# EAGLE schematic modul_frequency (EAGLE 7.7.0)

## Sheet 1 of 5
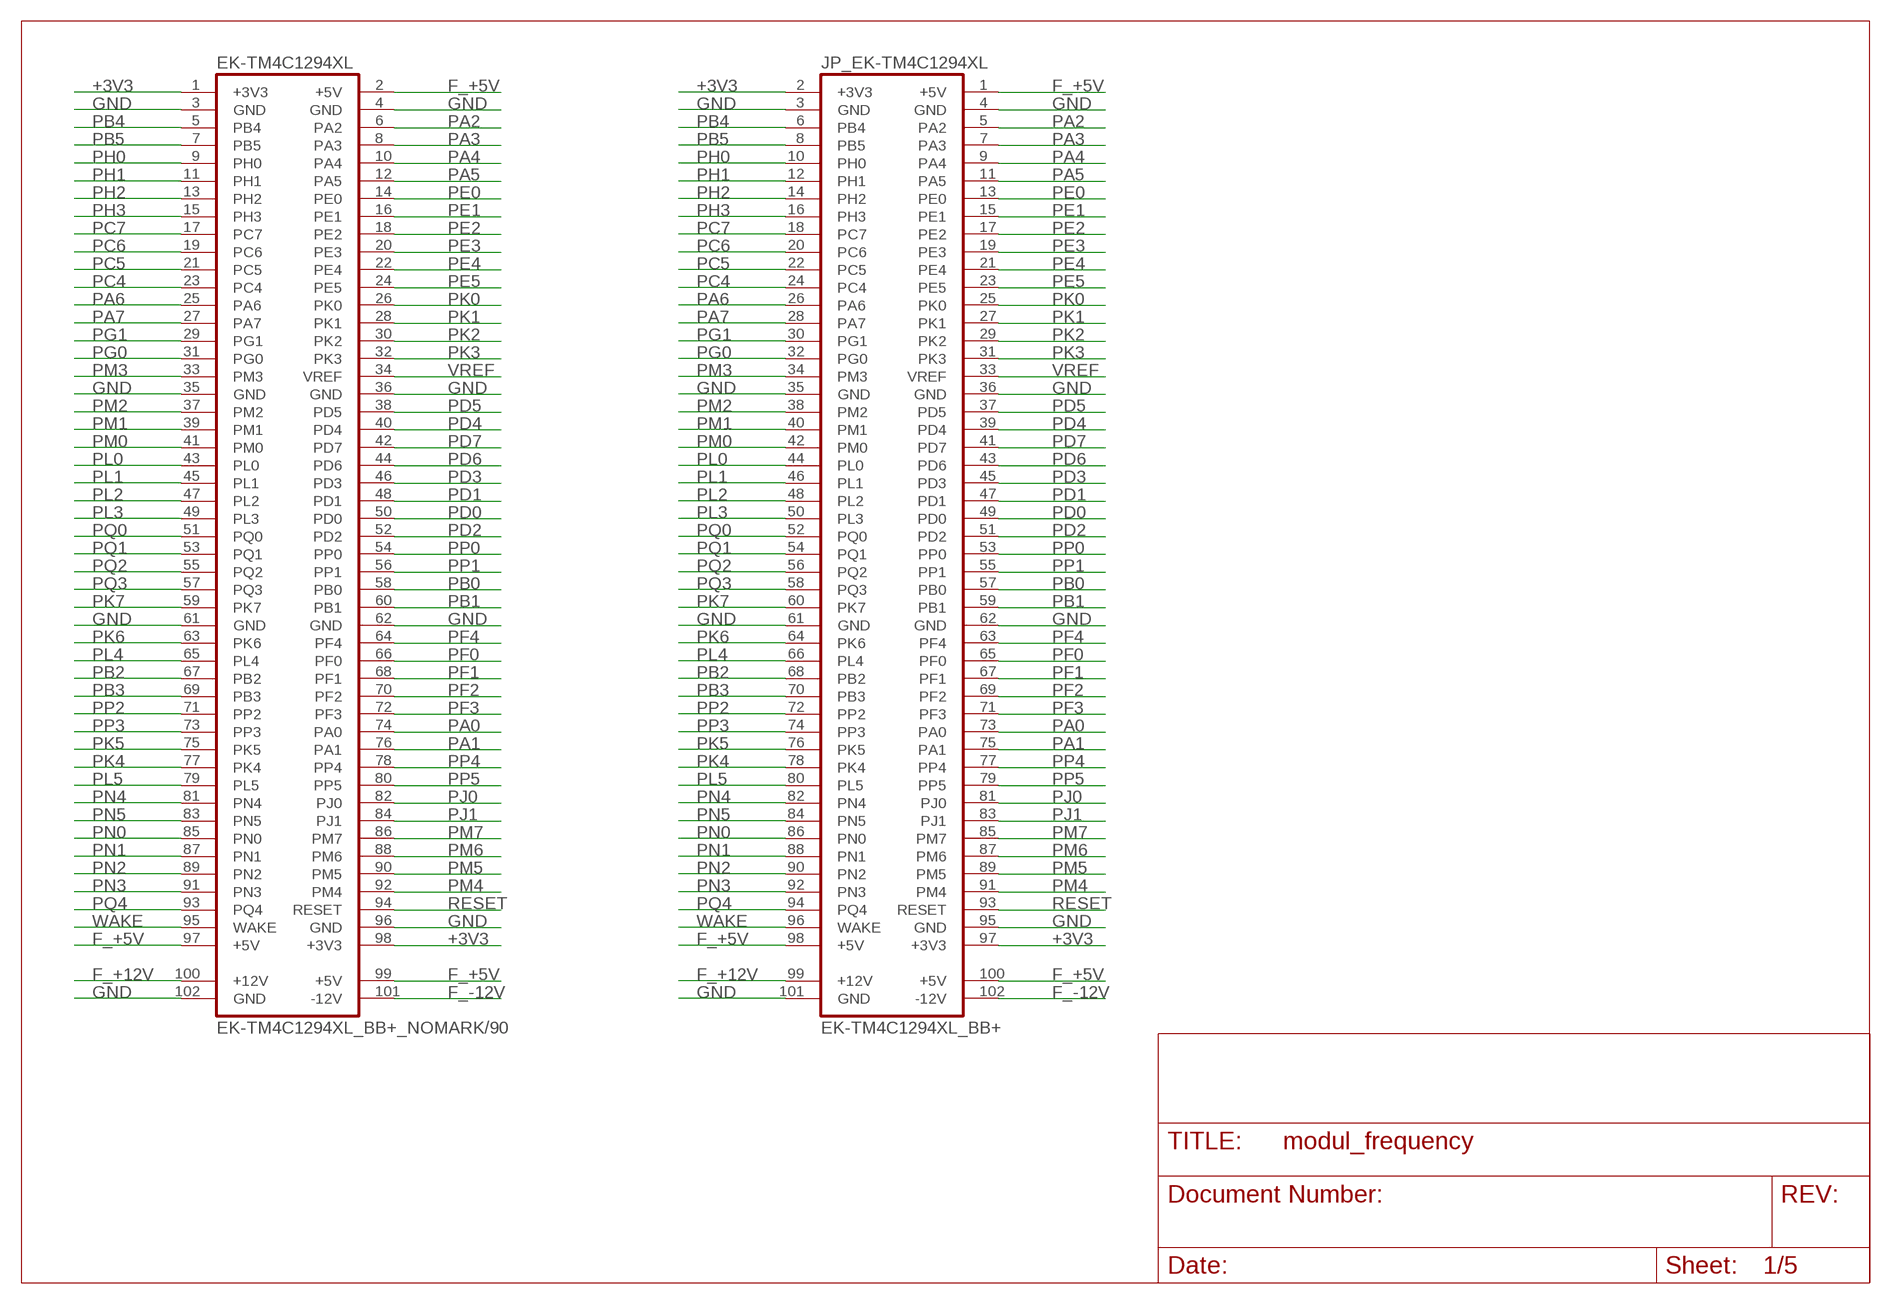
[diagram p0: schematic, sheet 1]

### Parts
EK-TM4C1294XL  EK-TM4C1294XL_BB+_NOMARK/90  [EK-TM4C1294XL_BB+_NOMARK/90]
JP_EK-TM4C1294XL  EK-TM4C1294XL_BB+  [EK-TM4C1294XL_BB+]

### Nets
+3V3: EK-TM4C1294XL.1(+3V3) EK-TM4C1294XL.98(+3V3) JP_EK-TM4C1294XL.2(+3V3) JP_EK-TM4C1294XL.97(+3V3) ; also sheet 2,3,4,5
F_+5V: EK-TM4C1294XL.2(+5V) EK-TM4C1294XL.97(+5V) EK-TM4C1294XL.99(+5V) JP_EK-TM4C1294XL.1(+5V) JP_EK-TM4C1294XL.98(+5V) JP_EK-TM4C1294XL.100(+5V) ; also sheet 2,3,4,5
F_+12V: EK-TM4C1294XL.100(+12V) JP_EK-TM4C1294XL.99(+12V) ; also sheet 4,5
F_-12V: EK-TM4C1294XL.101(-12V) JP_EK-TM4C1294XL.102(-12V)
GND: EK-TM4C1294XL.3(GND) EK-TM4C1294XL.4(GND) EK-TM4C1294XL.35(GND) EK-TM4C1294XL.36(GND) EK-TM4C1294XL.61(GND) EK-TM4C1294XL.62(GND) EK-TM4C1294XL.96(GND) EK-TM4C1294XL.102(GND) JP_EK-TM4C1294XL.3(GND) JP_EK-TM4C1294XL.4(GND) JP_EK-TM4C1294XL.35(GND) JP_EK-TM4C1294XL.36(GND) JP_EK-TM4C1294XL.61(GND) JP_EK-TM4C1294XL.62(GND) JP_EK-TM4C1294XL.95(GND) JP_EK-TM4C1294XL.101(GND) ; also sheet 2,3,5
PA0: EK-TM4C1294XL.74(PA0) JP_EK-TM4C1294XL.73(PA0) ; also sheet 4
PA1: EK-TM4C1294XL.76(PA1) JP_EK-TM4C1294XL.75(PA1) ; also sheet 4
PA2: EK-TM4C1294XL.6(PA2) JP_EK-TM4C1294XL.5(PA2) ; also sheet 4
PA3: EK-TM4C1294XL.8(PA3) JP_EK-TM4C1294XL.7(PA3) ; also sheet 4
PA4: EK-TM4C1294XL.10(PA4) JP_EK-TM4C1294XL.9(PA4) ; also sheet 4
PA5: EK-TM4C1294XL.12(PA5) JP_EK-TM4C1294XL.11(PA5) ; also sheet 4
PA6: EK-TM4C1294XL.25(PA6) JP_EK-TM4C1294XL.26(PA6) ; also sheet 4
PA7: EK-TM4C1294XL.27(PA7) JP_EK-TM4C1294XL.28(PA7) ; also sheet 4
PB0: EK-TM4C1294XL.58(PB0) JP_EK-TM4C1294XL.57(PB0)
PB1: EK-TM4C1294XL.60(PB1) JP_EK-TM4C1294XL.59(PB1)
PB2: EK-TM4C1294XL.67(PB2) JP_EK-TM4C1294XL.68(PB2)
PB3: EK-TM4C1294XL.69(PB3) JP_EK-TM4C1294XL.70(PB3)
PB4: EK-TM4C1294XL.5(PB4) JP_EK-TM4C1294XL.6(PB4)
PB5: EK-TM4C1294XL.7(PB5) JP_EK-TM4C1294XL.8(PB5)
PC4: EK-TM4C1294XL.23(PC4) JP_EK-TM4C1294XL.24(PC4)
PC5: EK-TM4C1294XL.21(PC5) JP_EK-TM4C1294XL.22(PC5)
PC6: EK-TM4C1294XL.19(PC6) JP_EK-TM4C1294XL.20(PC6)
PC7: EK-TM4C1294XL.17(PC7) JP_EK-TM4C1294XL.18(PC7)
PD0: EK-TM4C1294XL.50(PD0) JP_EK-TM4C1294XL.49(PD0) ; also sheet 4
PD1: EK-TM4C1294XL.48(PD1) JP_EK-TM4C1294XL.47(PD1) ; also sheet 4
PD2: EK-TM4C1294XL.52(PD2) JP_EK-TM4C1294XL.51(PD2) ; also sheet 4
PD3: EK-TM4C1294XL.46(PD3) JP_EK-TM4C1294XL.45(PD3) ; also sheet 4
PD4: EK-TM4C1294XL.40(PD4) JP_EK-TM4C1294XL.39(PD4) ; also sheet 4
PD5: EK-TM4C1294XL.38(PD5) JP_EK-TM4C1294XL.37(PD5) ; also sheet 4
PD6: EK-TM4C1294XL.44(PD6) JP_EK-TM4C1294XL.43(PD6)
PD7: EK-TM4C1294XL.42(PD7) JP_EK-TM4C1294XL.41(PD7)
PE0: EK-TM4C1294XL.14(PE0) JP_EK-TM4C1294XL.13(PE0)
PE1: EK-TM4C1294XL.16(PE1) JP_EK-TM4C1294XL.15(PE1)
PE2: EK-TM4C1294XL.18(PE2) JP_EK-TM4C1294XL.17(PE2)
PE3: EK-TM4C1294XL.20(PE3) JP_EK-TM4C1294XL.19(PE3)
PE4: EK-TM4C1294XL.22(PE4) JP_EK-TM4C1294XL.21(PE4)
PE5: EK-TM4C1294XL.24(PE5) JP_EK-TM4C1294XL.23(PE5)
PF0: EK-TM4C1294XL.66(PF0) JP_EK-TM4C1294XL.65(PF0)
PF1: EK-TM4C1294XL.68(PF1) JP_EK-TM4C1294XL.67(PF1)
PF2: EK-TM4C1294XL.70(PF2) JP_EK-TM4C1294XL.69(PF2)
PF3: EK-TM4C1294XL.72(PF3) JP_EK-TM4C1294XL.71(PF3)
PF4: EK-TM4C1294XL.64(PF4) JP_EK-TM4C1294XL.63(PF4)
PG0: EK-TM4C1294XL.31(PG0) JP_EK-TM4C1294XL.32(PG0)
PG1: EK-TM4C1294XL.29(PG1) JP_EK-TM4C1294XL.30(PG1)
PH0: EK-TM4C1294XL.9(PH0) JP_EK-TM4C1294XL.10(PH0)
PH1: EK-TM4C1294XL.11(PH1) JP_EK-TM4C1294XL.12(PH1)
PH2: EK-TM4C1294XL.13(PH2) JP_EK-TM4C1294XL.14(PH2)
PH3: EK-TM4C1294XL.15(PH3) JP_EK-TM4C1294XL.16(PH3)
PJ0: EK-TM4C1294XL.82(PJ0) JP_EK-TM4C1294XL.81(PJ0)
PJ1: EK-TM4C1294XL.84(PJ1) JP_EK-TM4C1294XL.83(PJ1)
PK0: EK-TM4C1294XL.26(PK0) JP_EK-TM4C1294XL.25(PK0) ; also sheet 4
PK1: EK-TM4C1294XL.28(PK1) JP_EK-TM4C1294XL.27(PK1) ; also sheet 4
PK2: EK-TM4C1294XL.30(PK2) JP_EK-TM4C1294XL.29(PK2) ; also sheet 4
PK3: EK-TM4C1294XL.32(PK3) JP_EK-TM4C1294XL.31(PK3) ; also sheet 4
PK4: EK-TM4C1294XL.77(PK4) JP_EK-TM4C1294XL.78(PK4)
PK5: EK-TM4C1294XL.75(PK5) JP_EK-TM4C1294XL.76(PK5)
PK6: EK-TM4C1294XL.63(PK6) JP_EK-TM4C1294XL.64(PK6)
PK7: EK-TM4C1294XL.59(PK7) JP_EK-TM4C1294XL.60(PK7)
PL0: EK-TM4C1294XL.43(PL0) JP_EK-TM4C1294XL.44(PL0)
PL1: EK-TM4C1294XL.45(PL1) JP_EK-TM4C1294XL.46(PL1)
PL2: EK-TM4C1294XL.47(PL2) JP_EK-TM4C1294XL.48(PL2)
PL3: EK-TM4C1294XL.49(PL3) JP_EK-TM4C1294XL.50(PL3)
PL4: EK-TM4C1294XL.65(PL4) JP_EK-TM4C1294XL.66(PL4) ; also sheet 4
PL5: EK-TM4C1294XL.79(PL5) JP_EK-TM4C1294XL.80(PL5) ; also sheet 4
PM0: EK-TM4C1294XL.41(PM0) JP_EK-TM4C1294XL.42(PM0) ; also sheet 4
PM1: EK-TM4C1294XL.39(PM1) JP_EK-TM4C1294XL.40(PM1) ; also sheet 4
PM2: EK-TM4C1294XL.37(PM2) JP_EK-TM4C1294XL.38(PM2) ; also sheet 4
PM3: EK-TM4C1294XL.33(PM3) JP_EK-TM4C1294XL.34(PM3) ; also sheet 4
PM4: EK-TM4C1294XL.92(PM4) JP_EK-TM4C1294XL.91(PM4) ; also sheet 4
PM5: EK-TM4C1294XL.90(PM5) JP_EK-TM4C1294XL.89(PM5) ; also sheet 4
PM6: EK-TM4C1294XL.88(PM6) JP_EK-TM4C1294XL.87(PM6) ; also sheet 4
PM7: EK-TM4C1294XL.86(PM7) JP_EK-TM4C1294XL.85(PM7) ; also sheet 4
PN0: EK-TM4C1294XL.85(PN0) JP_EK-TM4C1294XL.86(PN0)
PN1: EK-TM4C1294XL.87(PN1) JP_EK-TM4C1294XL.88(PN1)
PN2: EK-TM4C1294XL.89(PN2) JP_EK-TM4C1294XL.90(PN2)
PN3: EK-TM4C1294XL.91(PN3) JP_EK-TM4C1294XL.92(PN3)
PN4: EK-TM4C1294XL.81(PN4) JP_EK-TM4C1294XL.82(PN4)
PN5: EK-TM4C1294XL.83(PN5) JP_EK-TM4C1294XL.84(PN5)
PP0: EK-TM4C1294XL.54(PP0) JP_EK-TM4C1294XL.53(PP0)
PP1: EK-TM4C1294XL.56(PP1) JP_EK-TM4C1294XL.55(PP1)
PP2: EK-TM4C1294XL.71(PP2) JP_EK-TM4C1294XL.72(PP2)
PP3: EK-TM4C1294XL.73(PP3) JP_EK-TM4C1294XL.74(PP3)
PP4: EK-TM4C1294XL.78(PP4) JP_EK-TM4C1294XL.77(PP4)
PP5: EK-TM4C1294XL.80(PP5) JP_EK-TM4C1294XL.79(PP5)
PQ0: EK-TM4C1294XL.51(PQ0) JP_EK-TM4C1294XL.52(PQ0)
PQ1: EK-TM4C1294XL.53(PQ1) JP_EK-TM4C1294XL.54(PQ1)
PQ2: EK-TM4C1294XL.55(PQ2) JP_EK-TM4C1294XL.56(PQ2)
PQ3: EK-TM4C1294XL.57(PQ3) JP_EK-TM4C1294XL.58(PQ3)
PQ4: EK-TM4C1294XL.93(PQ4) JP_EK-TM4C1294XL.94(PQ4)
RESET: EK-TM4C1294XL.94(RESET) JP_EK-TM4C1294XL.93(RESET)
VREF: EK-TM4C1294XL.34(VREF) JP_EK-TM4C1294XL.33(VREF)
WAKE: EK-TM4C1294XL.95(WAKE) JP_EK-TM4C1294XL.96(WAKE)

## Sheet 2 of 5
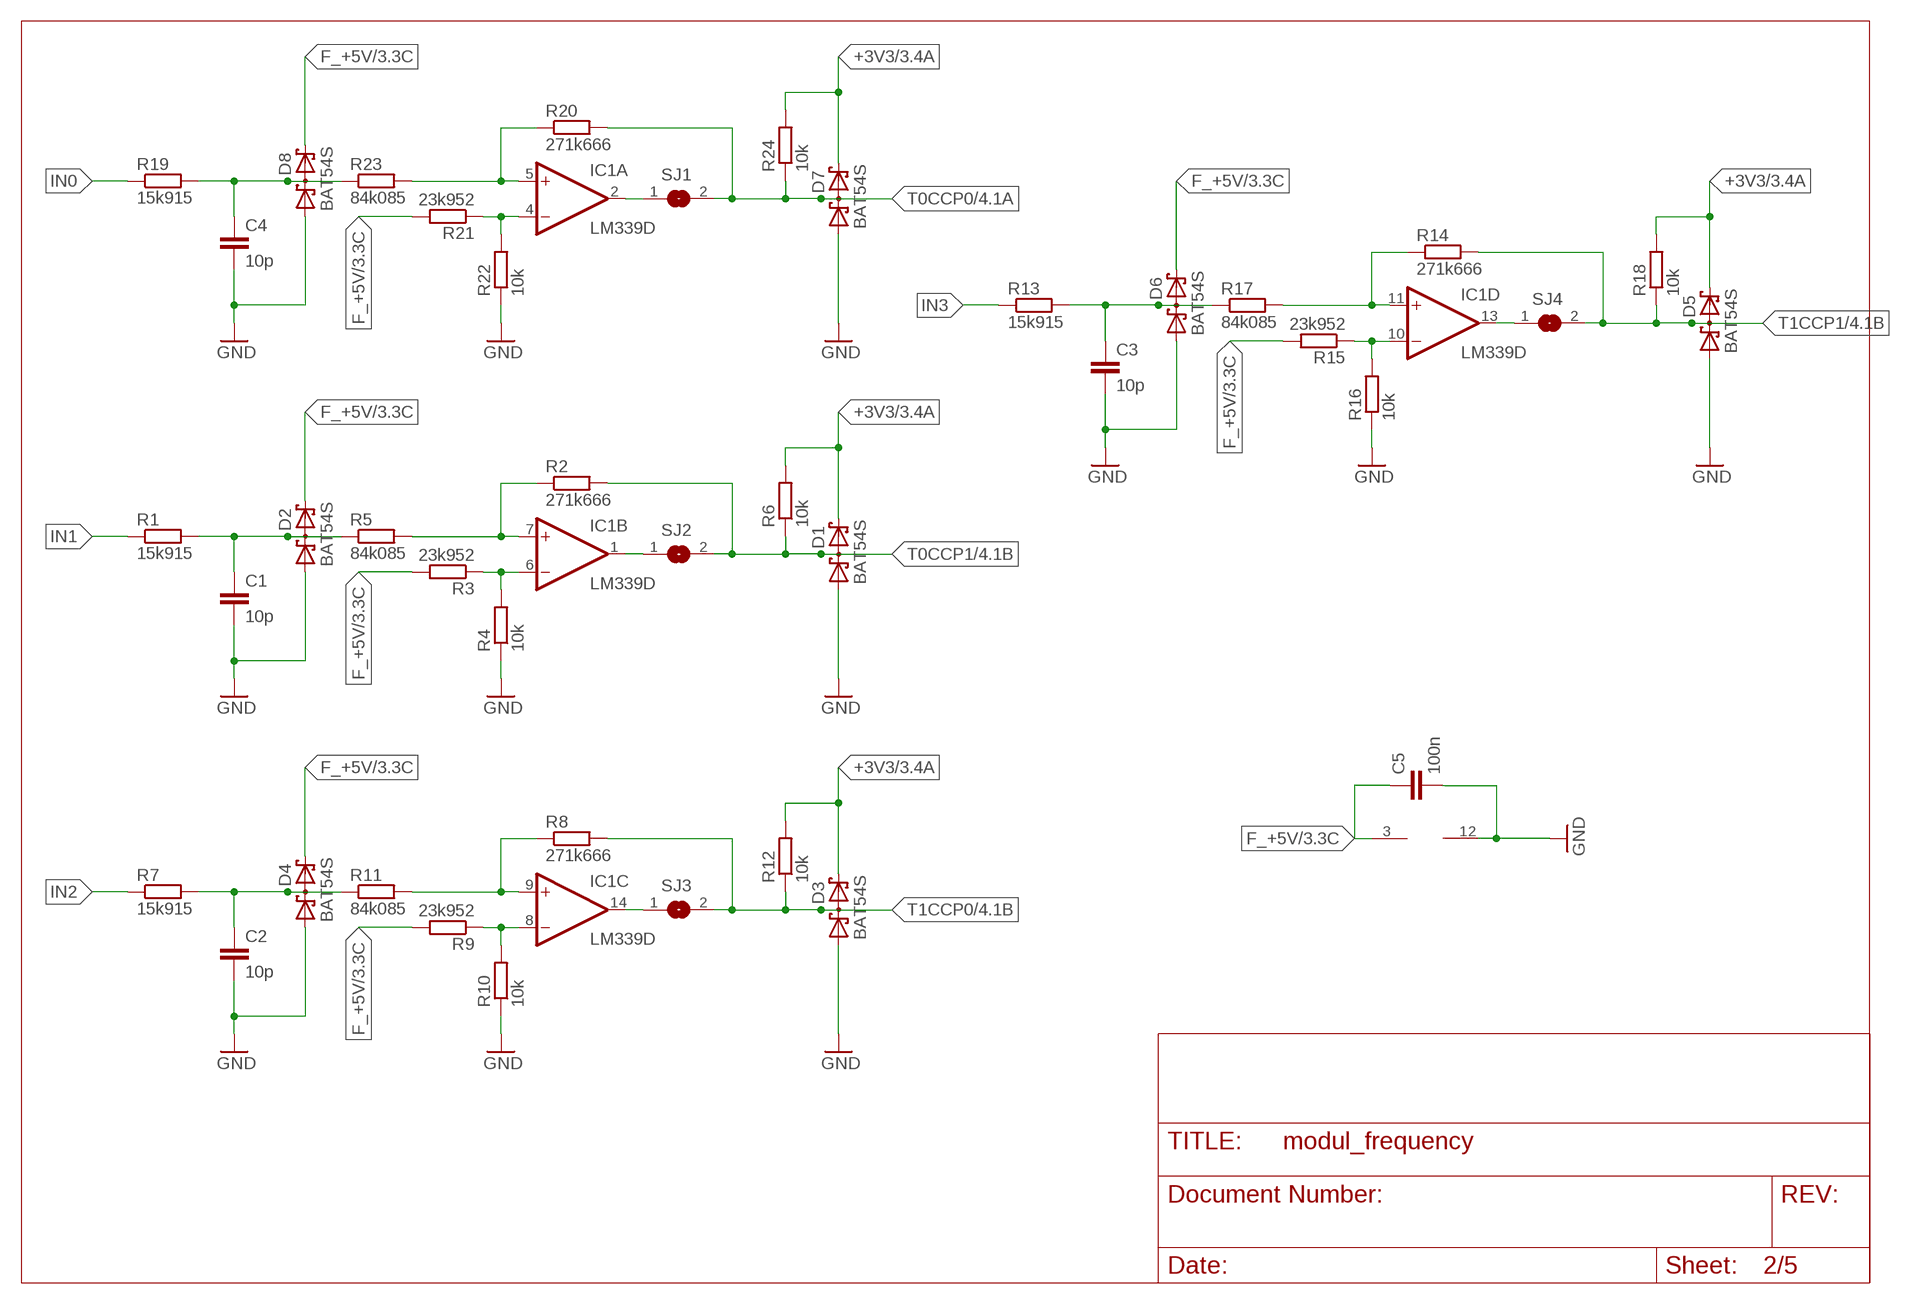
[diagram p1: schematic, sheet 2]

### Parts
C1  10p  C-EUC0805  [C0805]
C2  10p  C-EUC0805  [C0805]
C3  10p  C-EUC0805  [C0805]
C4  10p  C-EUC0805  [C0805]
C5  100n  C-EUC0805  [C0805]
D1  BAT54S  [SOT23]
D2  BAT54S  [SOT23]
D3  BAT54S  [SOT23]
D4  BAT54S  [SOT23]
D5  BAT54S  [SOT23]
D6  BAT54S  [SOT23]
D7  BAT54S  [SOT23]
D8  BAT54S  [SOT23]
IC1  LM339D  [SO14]
R1  15k915  R-EU_R0805  [R0805]
R2  271k666  R-EU_R0805  [R0805]
R3  23k952  R-EU_R0805  [R0805]
R4  10k  R-EU_R0805  [R0805]
R5  84k085  R-EU_R0805  [R0805]
R6  10k  R-EU_R0805  [R0805]
R7  15k915  R-EU_R0805  [R0805]
R8  271k666  R-EU_R0805  [R0805]
R9  23k952  R-EU_R0805  [R0805]
R10  10k  R-EU_R0805  [R0805]
R11  84k085  R-EU_R0805  [R0805]
R12  10k  R-EU_R0805  [R0805]
R13  15k915  R-EU_R0805  [R0805]
R14  271k666  R-EU_R0805  [R0805]
R15  23k952  R-EU_R0805  [R0805]
R16  10k  R-EU_R0805  [R0805]
R17  84k085  R-EU_R0805  [R0805]
R18  10k  R-EU_R0805  [R0805]
R19  15k915  R-EU_R0805  [R0805]
R20  271k666  R-EU_R0805  [R0805]
R21  23k952  R-EU_R0805  [R0805]
R22  10k  R-EU_R0805  [R0805]
R23  84k085  R-EU_R0805  [R0805]
R24  10k  R-EU_R0805  [R0805]
SJ1  SJ  [SJ]
SJ2  SJ  [SJ]
SJ3  SJ  [SJ]
SJ4  SJ  [SJ]

### Nets
+3V3: D1.2(C2) D3.2(C2) D5.2(C2) D7.2(C2) R6.2 R12.2 R18.2 R24.2 ; also sheet 1,3,4,5
F_+5V: C5.1 D2.2(C2) D4.2(C2) D6.2(C2) D8.2(C2) IC1.3(P:V+) R3.2 R9.2 R15.2 R21.2 ; also sheet 1,3,4,5
GND: C1.2 C2.2 C3.2 C4.2 C5.2 D1.1(A1) D2.1(A1) D3.1(A1) D4.1(A1) D5.1(A1) D6.1(A1) D7.1(A1) D8.1(A1) IC1.12(P:GND) R4.1 R10.1 R16.1 R22.1 ; also sheet 1,3,5
IN0: R19.1 ; also sheet 5
IN1: R1.1 ; also sheet 5
IN2: R7.1 ; also sheet 5
IN3: R13.1 ; also sheet 5
N$1: IC1.2(A:OUT) SJ1.1
N$3: IC1.7(B:+IN) R2.1 R5.2
N$4: IC1.6(B:-IN) R3.1 R4.2
N$5: C1.1 D2.3(C1A2) R1.2 R5.1
N$6: IC1.1(B:OUT) SJ2.1
N$7: IC1.9(C:+IN) R8.1 R11.2
N$8: IC1.8(C:-IN) R9.1 R10.2
N$9: C2.1 D4.3(C1A2) R7.2 R11.1
N$10: IC1.5(A:+IN) R20.1 R23.2
N$11: IC1.4(A:-IN) R21.1 R22.2
N$12: C4.1 D8.3(C1A2) R19.2 R23.1
N$13: IC1.14(C:OUT) SJ3.1
N$14: IC1.11(D:+IN) R14.1 R17.2
N$15: IC1.10(D:-IN) R15.1 R16.2
N$16: C3.1 D6.3(C1A2) R13.2 R17.1
N$17: IC1.13(D:OUT) SJ4.1
T0CCP0: D7.3(C1A2) R20.2 R24.1 SJ1.2 ; also sheet 4
T0CCP1: D1.3(C1A2) R2.2 R6.1 SJ2.2 ; also sheet 4
T1CCP0: D3.3(C1A2) R8.2 R12.1 SJ3.2 ; also sheet 4
T1CCP1: D5.3(C1A2) R14.2 R18.1 SJ4.2 ; also sheet 4

## Sheet 3 of 5
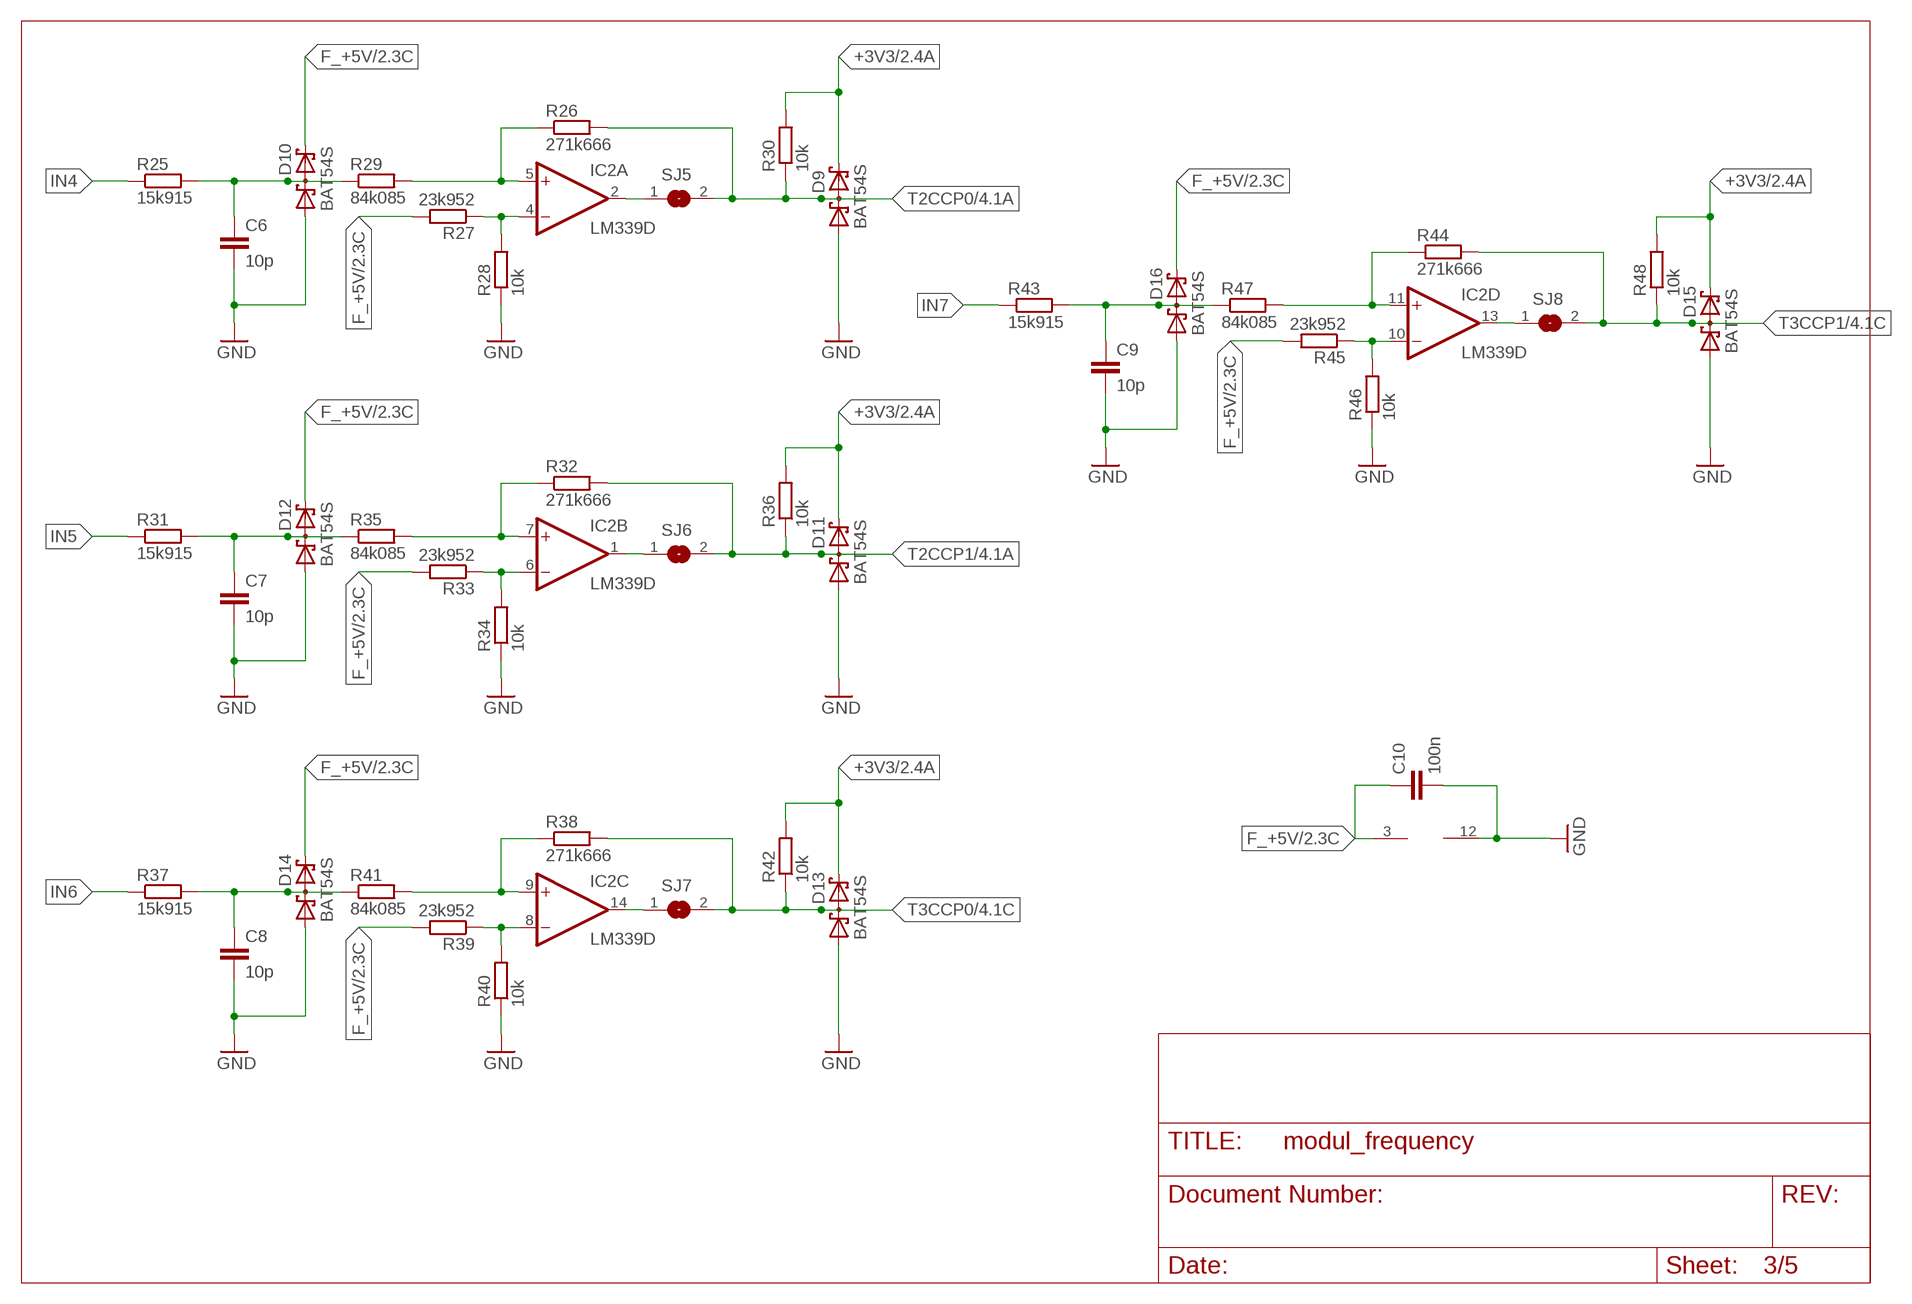
[diagram p2: schematic, sheet 3]

### Parts
C6  10p  C-EUC0805  [C0805]
C7  10p  C-EUC0805  [C0805]
C8  10p  C-EUC0805  [C0805]
C9  10p  C-EUC0805  [C0805]
C10  100n  C-EUC0805  [C0805]
D9  BAT54S  [SOT23]
D10  BAT54S  [SOT23]
D11  BAT54S  [SOT23]
D12  BAT54S  [SOT23]
D13  BAT54S  [SOT23]
D14  BAT54S  [SOT23]
D15  BAT54S  [SOT23]
D16  BAT54S  [SOT23]
IC2  LM339D  [SO14]
R25  15k915  R-EU_R0805  [R0805]
R26  271k666  R-EU_R0805  [R0805]
R27  23k952  R-EU_R0805  [R0805]
R28  10k  R-EU_R0805  [R0805]
R29  84k085  R-EU_R0805  [R0805]
R30  10k  R-EU_R0805  [R0805]
R31  15k915  R-EU_R0805  [R0805]
R32  271k666  R-EU_R0805  [R0805]
R33  23k952  R-EU_R0805  [R0805]
R34  10k  R-EU_R0805  [R0805]
R35  84k085  R-EU_R0805  [R0805]
R36  10k  R-EU_R0805  [R0805]
R37  15k915  R-EU_R0805  [R0805]
R38  271k666  R-EU_R0805  [R0805]
R39  23k952  R-EU_R0805  [R0805]
R40  10k  R-EU_R0805  [R0805]
R41  84k085  R-EU_R0805  [R0805]
R42  10k  R-EU_R0805  [R0805]
R43  15k915  R-EU_R0805  [R0805]
R44  271k666  R-EU_R0805  [R0805]
R45  23k952  R-EU_R0805  [R0805]
R46  10k  R-EU_R0805  [R0805]
R47  84k085  R-EU_R0805  [R0805]
R48  10k  R-EU_R0805  [R0805]
SJ5  SJ  [SJ]
SJ6  SJ  [SJ]
SJ7  SJ  [SJ]
SJ8  SJ  [SJ]

### Nets
+3V3: D9.2(C2) D11.2(C2) D13.2(C2) D15.2(C2) R30.2 R36.2 R42.2 R48.2 ; also sheet 1,2,4,5
F_+5V: C10.1 D10.2(C2) D12.2(C2) D14.2(C2) D16.2(C2) IC2.3(P:V+) R27.2 R33.2 R39.2 R45.2 ; also sheet 1,2,4,5
GND: C6.2 C7.2 C8.2 C9.2 C10.2 D9.1(A1) D10.1(A1) D11.1(A1) D12.1(A1) D13.1(A1) D14.1(A1) D15.1(A1) D16.1(A1) IC2.12(P:GND) R28.1 R34.1 R40.1 R46.1 ; also sheet 1,2,5
IN4: R25.1 ; also sheet 5
IN5: R31.1 ; also sheet 5
IN6: R37.1 ; also sheet 5
IN7: R43.1 ; also sheet 5
N$2: IC2.5(A:+IN) R26.1 R29.2
N$18: IC2.4(A:-IN) R27.1 R28.2
N$19: C6.1 D10.3(C1A2) R25.2 R29.1
N$20: IC2.7(B:+IN) R32.1 R35.2
N$21: IC2.6(B:-IN) R33.1 R34.2
N$22: C7.1 D12.3(C1A2) R31.2 R35.1
N$23: IC2.1(B:OUT) SJ6.1
N$24: IC2.9(C:+IN) R38.1 R41.2
N$25: IC2.8(C:-IN) R39.1 R40.2
N$26: C8.1 D14.3(C1A2) R37.2 R41.1
N$27: IC2.14(C:OUT) SJ7.1
N$28: IC2.11(D:+IN) R44.1 R47.2
N$29: IC2.10(D:-IN) R45.1 R46.2
N$30: C9.1 D16.3(C1A2) R43.2 R47.1
N$31: IC2.13(D:OUT) SJ8.1
N$32: IC2.2(A:OUT) SJ5.1
T2CCP0: D9.3(C1A2) R26.2 R30.1 SJ5.2 ; also sheet 4
T2CCP1: D11.3(C1A2) R32.2 R36.1 SJ6.2 ; also sheet 4
T3CCP0: D13.3(C1A2) R38.2 R42.1 SJ7.2 ; also sheet 4
T3CCP1: D15.3(C1A2) R44.2 R48.1 SJ8.2 ; also sheet 4

## Sheet 4 of 5
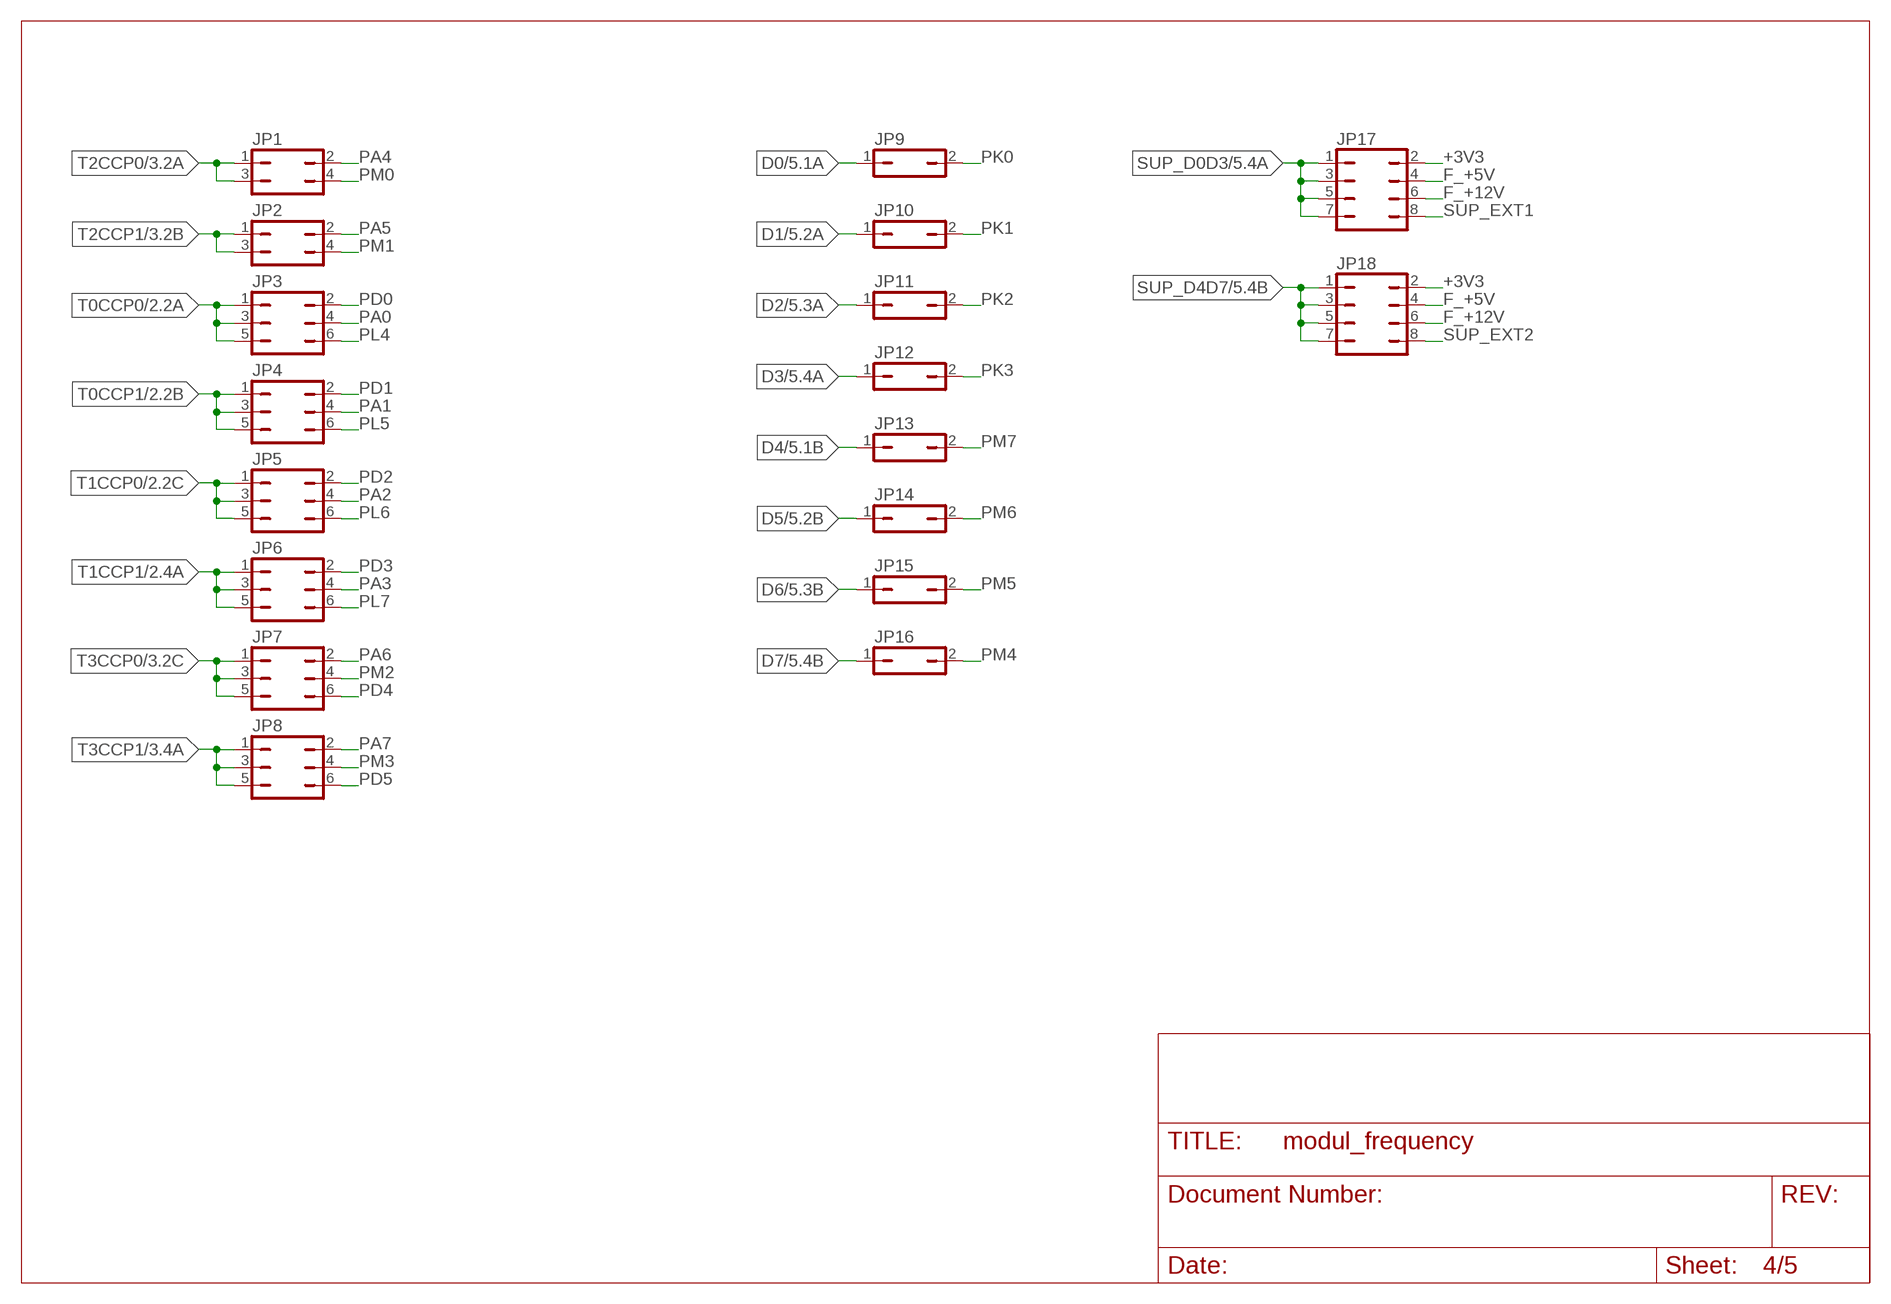
[diagram p3: schematic, sheet 4]

### Parts
JP1  JP2Q  [JP2Q]
JP2  JP2Q  [JP2Q]
JP3  JP3Q  [JP3Q]
JP4  JP3Q  [JP3Q]
JP5  JP3Q  [JP3Q]
JP6  JP3Q  [JP3Q]
JP7  JP3Q  [JP3Q]
JP8  JP3Q  [JP3Q]
JP9  JP1Q  [JP1]
JP10  JP1Q  [JP1]
JP11  JP1Q  [JP1]
JP12  JP1Q  [JP1]
JP13  JP1Q  [JP1]
JP14  JP1Q  [JP1]
JP15  JP1Q  [JP1]
JP16  JP1Q  [JP1]
JP17  JP4Q  [JP4Q]
JP18  JP4Q  [JP4Q]

### Nets
+3V3: JP17.2 JP18.2 ; also sheet 1,2,3,5
D0: JP9.1 ; also sheet 5
D1: JP10.1 ; also sheet 5
D2: JP11.1 ; also sheet 5
D3: JP12.1 ; also sheet 5
D4: JP13.1 ; also sheet 5
D5: JP14.1 ; also sheet 5
D6: JP15.1 ; also sheet 5
D7: JP16.1 ; also sheet 5
F_+5V: JP17.4 JP18.4 ; also sheet 1,2,3,5
F_+12V: JP17.6 JP18.6 ; also sheet 1,5
PA0: JP3.4 ; also sheet 1
PA1: JP4.4 ; also sheet 1
PA2: JP5.4 ; also sheet 1
PA3: JP6.4 ; also sheet 1
PA4: JP1.2 ; also sheet 1
PA5: JP2.2 ; also sheet 1
PA6: JP7.2 ; also sheet 1
PA7: JP8.2 ; also sheet 1
PD0: JP3.2 ; also sheet 1
PD1: JP4.2 ; also sheet 1
PD2: JP5.2 ; also sheet 1
PD3: JP6.2 ; also sheet 1
PD4: JP7.6 ; also sheet 1
PD5: JP8.6 ; also sheet 1
PK0: JP9.2 ; also sheet 1
PK1: JP10.2 ; also sheet 1
PK2: JP11.2 ; also sheet 1
PK3: JP12.2 ; also sheet 1
PL4: JP3.6 ; also sheet 1
PL5: JP4.6 ; also sheet 1
PL6: JP5.6
PL7: JP6.6
PM0: JP1.4 ; also sheet 1
PM1: JP2.4 ; also sheet 1
PM2: JP7.4 ; also sheet 1
PM3: JP8.4 ; also sheet 1
PM4: JP16.2 ; also sheet 1
PM5: JP15.2 ; also sheet 1
PM6: JP14.2 ; also sheet 1
PM7: JP13.2 ; also sheet 1
SUP_D0D3: JP17.1 JP17.3 JP17.5 JP17.7 ; also sheet 5
SUP_D4D7: JP18.1 JP18.3 JP18.5 JP18.7 ; also sheet 5
SUP_EXT1: JP17.8 ; also sheet 5
SUP_EXT2: JP18.8 ; also sheet 5
T0CCP0: JP3.1 JP3.3 JP3.5 ; also sheet 2
T0CCP1: JP4.1 JP4.3 JP4.5 ; also sheet 2
T1CCP0: JP5.1 JP5.3 JP5.5 ; also sheet 2
T1CCP1: JP6.1 JP6.3 JP6.5 ; also sheet 2
T2CCP0: JP1.1 JP1.3 ; also sheet 3
T2CCP1: JP2.1 JP2.3 ; also sheet 3
T3CCP0: JP7.1 JP7.3 JP7.5 ; also sheet 3
T3CCP1: JP8.1 JP8.3 JP8.5 ; also sheet 3

## Sheet 5 of 5
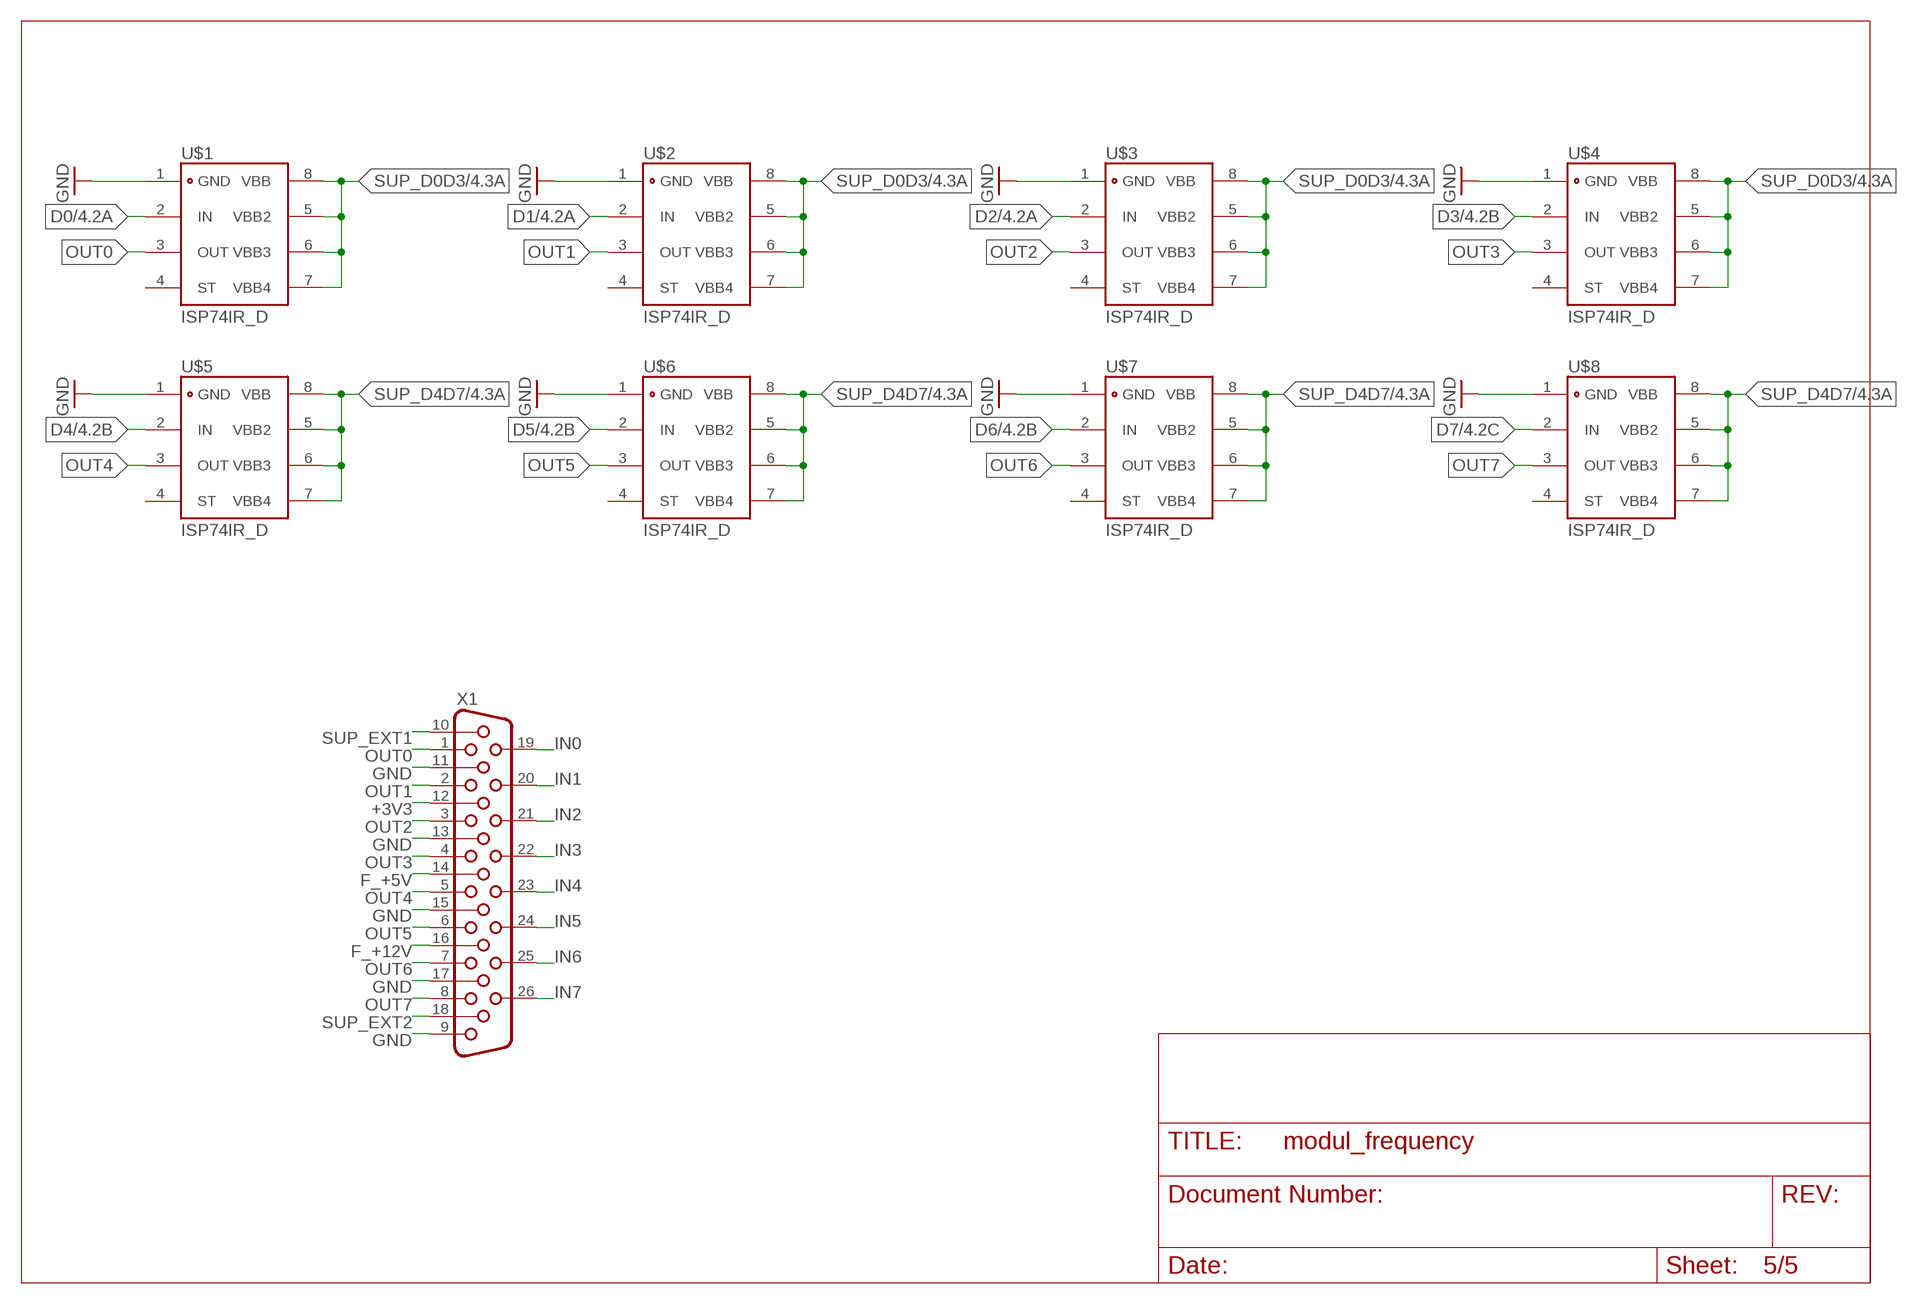
[diagram p4: schematic, sheet 5]

### Parts
U$1  ISP74IR_D  [SO08]
U$2  ISP74IR_D  [SO08]
U$3  ISP74IR_D  [SO08]
U$4  ISP74IR_D  [SO08]
U$5  ISP74IR_D  [SO08]
U$6  ISP74IR_D  [SO08]
U$7  ISP74IR_D  [SO08]
U$8  ISP74IR_D  [SO08]
X1  HF26H  [HDF26H]

### Nets
+3V3: X1.12 ; also sheet 1,2,3,4
D0: U$1.2(IN) ; also sheet 4
D1: U$2.2(IN) ; also sheet 4
D2: U$3.2(IN) ; also sheet 4
D3: U$4.2(IN) ; also sheet 4
D4: U$5.2(IN) ; also sheet 4
D5: U$6.2(IN) ; also sheet 4
D6: U$7.2(IN) ; also sheet 4
D7: U$8.2(IN) ; also sheet 4
F_+5V: X1.14 ; also sheet 1,2,3,4
F_+12V: X1.16 ; also sheet 1,4
GND: U$1.1(GND) U$2.1(GND) U$3.1(GND) U$4.1(GND) U$5.1(GND) U$6.1(GND) U$7.1(GND) U$8.1(GND) X1.9 X1.11 X1.13 X1.15 X1.17 ; also sheet 1,2,3
IN0: X1.19 ; also sheet 2
IN1: X1.20 ; also sheet 2
IN2: X1.21 ; also sheet 2
IN3: X1.22 ; also sheet 2
IN4: X1.23 ; also sheet 3
IN5: X1.24 ; also sheet 3
IN6: X1.25 ; also sheet 3
IN7: X1.26 ; also sheet 3
OUT0: U$1.3(OUT) X1.1
OUT1: U$2.3(OUT) X1.2
OUT2: U$3.3(OUT) X1.3
OUT3: U$4.3(OUT) X1.4
OUT4: U$5.3(OUT) X1.5
OUT5: U$6.3(OUT) X1.6
OUT6: U$7.3(OUT) X1.7
OUT7: U$8.3(OUT) X1.8
SUP_D0D3: U$1.5(VBB2) U$1.6(VBB3) U$1.7(VBB4) U$1.8(VBB) U$2.5(VBB2) U$2.6(VBB3) U$2.7(VBB4) U$2.8(VBB) U$3.5(VBB2) U$3.6(VBB3) U$3.7(VBB4) U$3.8(VBB) U$4.5(VBB2) U$4.6(VBB3) U$4.7(VBB4) U$4.8(VBB) ; also sheet 4
SUP_D4D7: U$5.5(VBB2) U$5.6(VBB3) U$5.7(VBB4) U$5.8(VBB) U$6.5(VBB2) U$6.6(VBB3) U$6.7(VBB4) U$6.8(VBB) U$7.5(VBB2) U$7.6(VBB3) U$7.7(VBB4) U$7.8(VBB) U$8.5(VBB2) U$8.6(VBB3) U$8.7(VBB4) U$8.8(VBB) ; also sheet 4
SUP_EXT1: X1.10 ; also sheet 4
SUP_EXT2: X1.18 ; also sheet 4
Unconnected: U$1.4(ST) U$2.4(ST) U$3.4(ST) U$4.4(ST) U$5.4(ST) U$6.4(ST) U$7.4(ST) U$8.4(ST)

## Library data of the parts
C1-C10 = rcl:C-EU: CAPACITOR, European symbol
D1-D16 = diode:BAT54S: Schottky Diodes Pin connection corrected 2011-05-04 Source: Fairchild .. BAT54.pdf
EK-TM4C1294XL JP_EK-TM4C1294XL = ownparts:EK-TM4C1294XL_BB+
IC1 IC2 = linear:LM339: Low Power Low Offset Voltage Quad Comparators with open collector; LM139/LM239/LM339/LM2901/LM3302
JP1 JP2 = jumper:JP2Q: JUMPER
JP3-JP8 = jumper:JP3Q: JUMPER
JP9-JP16 = jumper:JP1Q: JUMPER
JP17 JP18 = jumper:JP4Q: JUMPER
R1-R48 = rcl:R-EU_: RESISTOR, European symbol
SJ1-SJ8 = jumper:SJ: SMD solder JUMPER
U$1-U$8 = isp742ri:ISP74IR_D
X1 = con-subd:HF26: SUB-D; OC_FARNELL: unknown; OC_NEWARK: unknown